# Altium project PCB_Inductor_board.PrjPcb
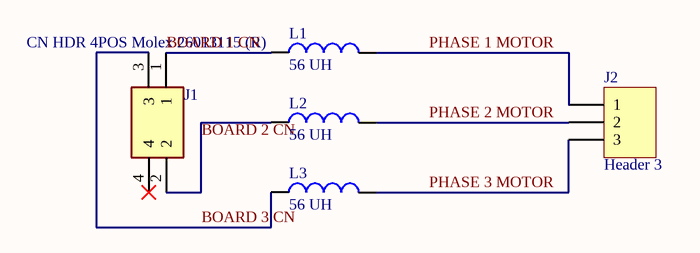
[diagram p0: SCH_Inductor_board.SchDoc]
1 sheet, 5 parts. Net scope: global (net labels, ports and power ports of the same name join across sheets).
Board file: PC_ind_board.PcbDoc

## Sheet SCH_Inductor_board.SchDoc
size A

### Parts
J1  CN HDR 4POS Molex 26013115 (R)  [26013115]
J2  Header 3  [HDR1X3]
L1  56 UH  [EATON _HCM1A1307V2-560-R]
L2  56 UH  [EATON _HCM1A1307V2-560-R]
L3  56 UH  [EATON _HCM1A1307V2-560-R]

### Nets
BOARD 1 CN: J1.1 L1.1
BOARD 2 CN: J1.2 L2.1
BOARD 3 CN: J1.3 L3.1
PHASE 1 MOTOR: J2.1 L1.2
PHASE 2 MOTOR: J2.2 L2.2
PHASE 3 MOTOR: J2.3 L3.2

Not connected (* = marked no-connect by the designer): J1 4*

### Library data of the parts
J1 = CN HDR 4POS Molex 26013115 (R): Molex 26013115 4POS Minifit / dual row, right angle
J2 = Header 3: Header, 3-Pin; LatestRevisionDate: 17-Jul-2002; LatestRevisionNote: Re-released for DXP Platform.; Publisher: Altium Limited
L1-L3 = IND 56UH 4A 65 mOHM SMD: FIXED!! IND 56UH 4A 65 MOHM SMD Shielded - Inductor 65mOhm Max Nonstandard -; Value: 56 µH; Digi-Key Part Number: 283-HCM1A1307V2-560-RTR-ND; Current Rating: 4A; DC Resistance: 65mOhm; Supplier 1: Digi-Key; Supplier Part Number 1: 283-HCM1A1307V2-560-RCT-ND